# Altium schematic sheet MB_power_supply.SchDoc
size A3
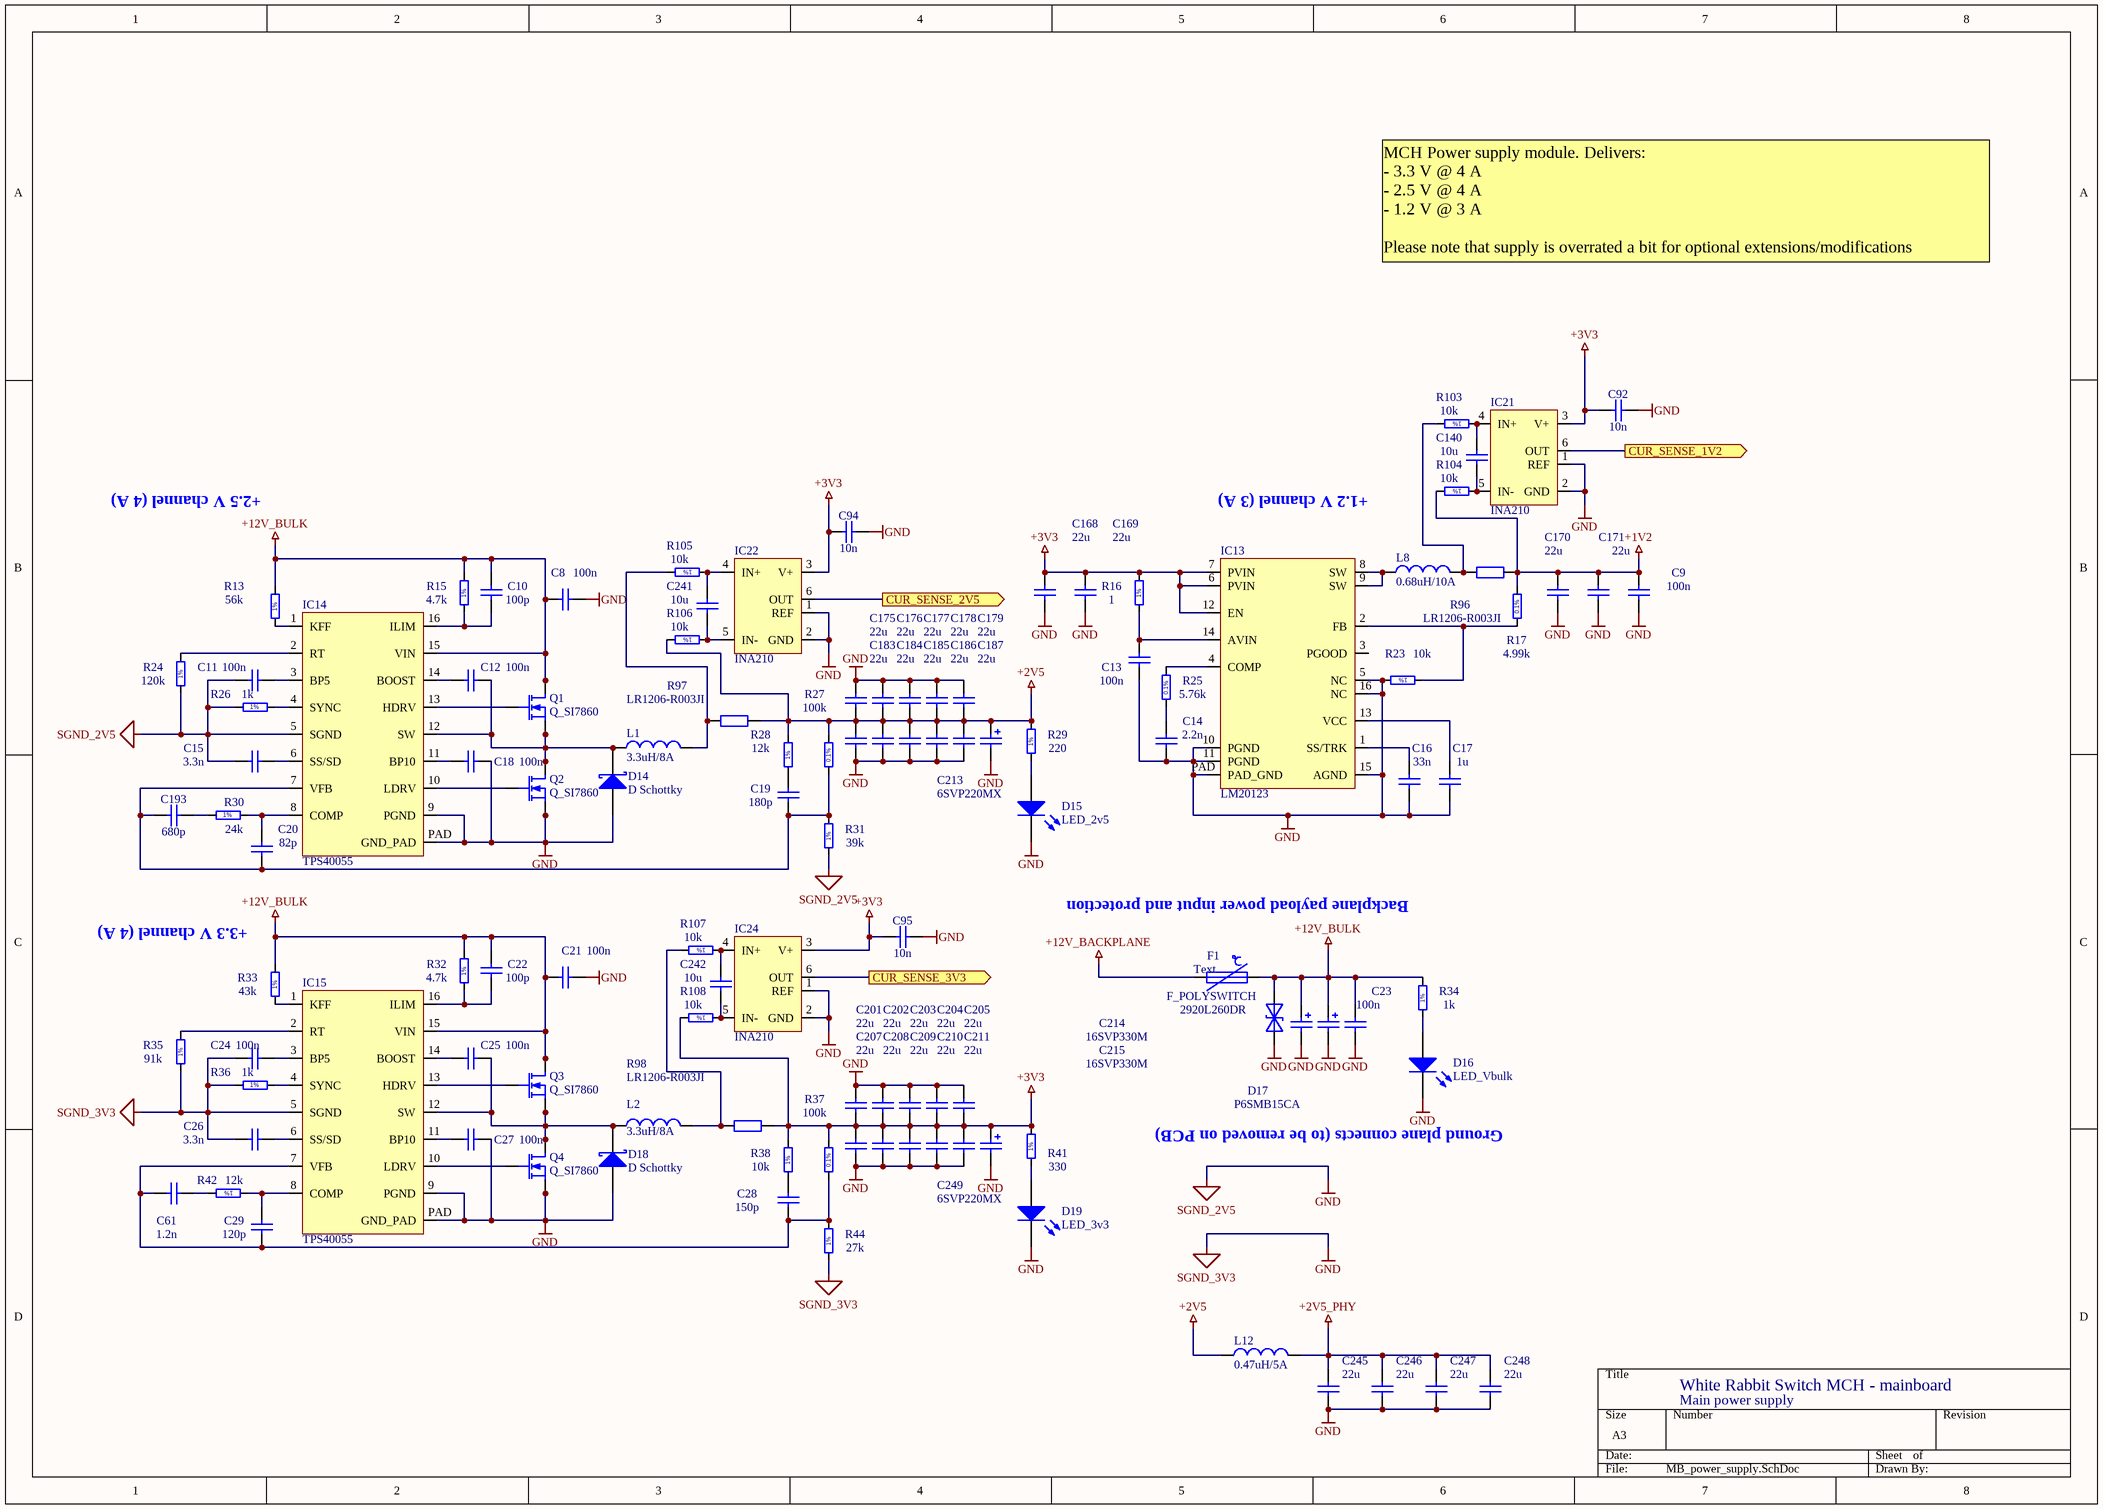
[diagram p0: MB_power_supply.SchDoc]

## Parts
C8  100n  [CAPC1608X87N]
C9  100n  [CAPC1608X87N]
C10  100p  [CAPC1608X87N]
C11  100n  [CAPC1608X87N]
C12  100n  [CAPC1608X87N]
C13  100n  [CAPC1608X87N]
C14  2.2n  [CAPC1608X87N]
C15  3.3n  [CAPC1608X87N]
C16  33n  [CAPC1608X87N]
C17  1u  [CAPC1608X87N]
C18  100n  [CAPC1608X87N]
C19  180p  [CAPC1608X87N]
C20  82p  [CAPC1608X87N]
C21  100n  [CAPC1608X87N]
C22  100p  [CAPC1608X87N]
C23  100n  [CAPC1608X87N]
C24  100n  [CAPC1608X87N]
C25  100n  [CAPC1608X87N]
C26  3.3n  [CAPC1608X87N]
C27  100n  [CAPC1608X87N]
C28  150p  [CAPC1608X87N]
C29  120p  [CAPC1608X87N]
C61  1.2n  [CAPC1608X87N]
C92  10n  [CAPC1608X87N]
C94  10n  [CAPC1608X87N]
C95  10n  [CAPC1608X87N]
C140  10u  [CAPC1608X87N]
C168  value 22u  [CC3216-1206]  (hidden comment: Cap)
C169  value 22u  [CC3216-1206]  (hidden comment: Cap)
C170  value 22u  [CC3216-1206]  (hidden comment: Cap)
C171  value 22u  [CC3216-1206]  (hidden comment: Cap)
C175  value 22u  [CC3216-1206]  (hidden comment: Cap)
C176  value 22u  [CC3216-1206]  (hidden comment: Cap)
C177  value 22u  [CC3216-1206]  (hidden comment: Cap)
C178  value 22u  [CC3216-1206]  (hidden comment: Cap)
C179  value 22u  [CC3216-1206]  (hidden comment: Cap)
C183  value 22u  [CC3216-1206]  (hidden comment: Cap)
C184  value 22u  [CC3216-1206]  (hidden comment: Cap)
C185  value 22u  [CC3216-1206]  (hidden comment: Cap)
C186  value 22u  [CC3216-1206]  (hidden comment: Cap)
C187  value 22u  [CC3216-1206]  (hidden comment: Cap)
C193  680p  [CAPC1608X87N]
C201  value 22u  [CC3216-1206]  (hidden comment: Cap)
C202  value 22u  [CC3216-1206]  (hidden comment: Cap)
C203  value 22u  [CC3216-1206]  (hidden comment: Cap)
C204  value 22u  [CC3216-1206]  (hidden comment: Cap)
C205  value 22u  [CC3216-1206]  (hidden comment: Cap)
C207  value 22u  [CC3216-1206]  (hidden comment: Cap)
C208  value 22u  [CC3216-1206]  (hidden comment: Cap)
C209  value 22u  [CC3216-1206]  (hidden comment: Cap)
C210  value 22u  [CC3216-1206]  (hidden comment: Cap)
C211  value 22u  [CC3216-1206]  (hidden comment: Cap)
C213  value 6SVP220MX  [OSCON_E7]  (hidden comment: Cap Pol1)
C214  value 16SVP330M  [OSCON_F12]  (hidden comment: Cap Pol1)
C215  value 16SVP330M  [OSCON_F12]  (hidden comment: Cap Pol1)
C241  10u  [CAPC1608X87N]
C242  10u  [CAPC1608X87N]
C245  value 22u  [CC3216-1206]  (hidden comment: Cap)
C246  value 22u  [CC3216-1206]  (hidden comment: Cap)
C247  value 22u  [CC3216-1206]  (hidden comment: Cap)
C248  value 22u  [CC3216-1206]  (hidden comment: Cap)
C249  value 6SVP220MX  [OSCON_E7]  (hidden comment: Cap Pol1)
D14  D Schottky  [CD3216-1206]
D15  LED_2v5  [CD1608-0603]
D16  LED_Vbulk  [CD1608-0603]
D17  P6SMB15CA  [DO-214AA/SMB]
D18  D Schottky  [CD3216-1206]
D19  LED_3v3  [CD1608-0603]
F1  F_POLYSWITCH  value 2920L260DR  [PTC_SMD_1812]
IC13  LM20123  [eTSSOP_16_MX]
IC14  value TPS40055  [TI_PWP_16]  (hidden comment: TPS4005X)
IC15  value TPS40055  [TI_PWP_16]  (hidden comment: TPS4005X)
IC21  INA210  [TI_6sc70]
IC22  INA210  [TI_6sc70]
IC24  INA210  [TI_6sc70]
L1  3.3uH/8A  [IHLP2525]
L2  3.3uH/8A  [IHLP2525]
L8  0.68uH/10A  [IHLP2525]
L12  0.47uH/5A  [IND_WURTH_744042_MH]
Q1  Q_SI7860  [SOIC127P600-8AL]
Q2  Q_SI7860  [SOIC127P600-8AL]
Q3  Q_SI7860  [SOIC127P600-8AL]
Q4  Q_SI7860  [SOIC127P600-8AL]
R13  56k  [RESC1608X55N]
R15  4.7k  [RESC1608X55N]
R16  1  [RESC1608X55N]
R17  4.99k  [RESC1608X55N]
R23  10k  [RESC1608X55N]
R24  120k  [RESC1608X55N]
R25  5.76k  [RESC1608X55N]
R26  1k  [RESC1608X55N]
R27  100k  [RESC1608X55N]
R28  12k  [RESC1608X55N]
R29  220  [RESC1608X55N]
R30  24k  [RESC1608X55N]
R31  39k  [RESC1608X55N]
R32  4.7k  [RESC1608X55N]
R33  43k  [RESC1608X55N]
R34  1k  [RESC1005X40N]
R35  91k  [RESC1608X55N]
R36  1k  [RESC1608X55N]
R37  100k  [RESC1608X55N]
R38  10k  [RESC1608X55N]
R41  330  [RESC1608X55N]
R42  12k  [RESC1608X55N]
R44  27k  [RESC1608X55N]
R96  value LR1206-R003JI  [CR3216-1206]  (hidden comment: 0.003R)
R97  value LR1206-R003JI  [CR3216-1206]  (hidden comment: 0.003R)
R98  value LR1206-R003JI  [CR3216-1206]  (hidden comment: 0.003R)
R103  10k  [RESC1005X40N]
R104  10k  [RESC1005X40N]
R105  10k  [RESC1005X40N]
R106  10k  [RESC1005X40N]
R107  10k  [RESC1005X40N]
R108  10k  [RESC1005X40N]

## Ports
CUR_SENSE_1V2 (out), CUR_SENSE_2V5 (out), CUR_SENSE_3V3 (out)

## Nets
+1V2: C9.2 C170.2 C171.2 R17.2 R96.1 R104.2
+2V5: C175.1 C176.1 C177.1 C178.1 C179.1 C183.2 C184.2 C185.2 C186.2 C187.2 C213.1 L12.1 R27.2 R28.2 R29.2 R97.1 R106.2
+2V5_PHY: C245.2 C246.2 C247.2 C248.2 L12.2
+3V3: C92.1 C94.1 C95.1 C168.2 C169.2 C201.2 C202.2 C203.2 C204.2 C205.2 C207.1 C208.1 C209.1 C210.1 C211.1 C249.1 IC13.6(PVIN) IC13.7(PVIN) IC13.12(EN) IC21.3(V+) IC22.3(V+) IC24.3(V+) R16.2 R37.2 R38.2 R41.2 R98.1 R108.2
+12V_BACKPLANE: F1.1
+12V_BULK: C8.1 C10.2 C21.1 C22.2 C23.2 C214.1 C215.1 D17.K F1.2 IC14.15(VIN) IC15.15(VIN) Q1.5(D) Q1.6(D) Q1.7(D) Q1.8(D) Q3.5(D) Q3.6(D) Q3.7(D) Q3.8(D) R13.2 R15.2 R32.2 R33.2 R34.2
GND: C8.2 C9.1 C11.1 C13.1 C14.1 C15.1 C16.1 C17.1 C18.2 C21.2 C23.1 C24.1 C26.1 C27.2 C92.2 C94.2 C95.2 C168.1 C169.1 C170.1 C171.1 C175.2 C176.2 C177.2 C178.2 C179.2 C183.1 C184.1 C185.1 C186.1 C187.1 C201.1 C202.1 C203.1 C204.1 C205.1 C207.2 C208.2 C209.2 C210.2 C211.2 C213.2 C214.2 C215.2 C245.1 C246.1 C247.1 C248.1 C249.2 D14.1(A) D15.2(K) D16.2(K) D17.A D18.1(A) D19.2(K) IC13.5(NC) IC13.10(PGND) IC13.11(PGND) IC13.15(AGND) IC13.16(NC) IC13.PAD(PAD_GND) IC14.5(SGND) IC14.9(PGND) IC14.PAD(GND_PAD) IC15.5(SGND) IC15.9(PGND) IC15.PAD(GND_PAD) IC21.1(REF) IC21.2(GND) IC22.1(REF) IC22.2(GND) IC24.1(REF) IC24.2(GND) Q2.1(S) Q2.2(S) Q2.3(S) Q4.1(S) Q4.2(S) Q4.3(S) R23.2 R24.1 R26.1 R31.1 R35.1 R36.1 R44.1  [also labelled SGND_2V5, SGND_3V3]
CUR_SENSE_1V2: IC21.6(OUT) ; port CUR_SENSE_1V2
CUR_SENSE_2V5: IC22.6(OUT) ; port CUR_SENSE_2V5
CUR_SENSE_3V3: IC24.6(OUT) ; port CUR_SENSE_3V3
NetC10_1: C10.1 IC14.16(ILIM) R15.1
NetC11_2: C11.2 IC14.3(BP5)
NetC12_1: C12.1 IC14.14(BOOST)
NetC12_2: C12.2 D14.2(K) IC14.12(SW) L1.1 Q1.1(S) Q1.2(S) Q1.3(S) Q2.5(D) Q2.6(D) Q2.7(D) Q2.8(D)
NetC13_2: C13.2 IC13.14(AVIN) R16.1
NetC14_2: C14.2 R25.1
NetC15_2: C15.2 IC14.6(SS/SD)
NetC16_2: C16.2 IC13.1(SS/TRK)
NetC17_2: C17.2 IC13.13(VCC)
NetC18_1: C18.1 IC14.11(BP10)
NetC19_1: C19.1 C20.1 C193.1 IC14.7(VFB) R27.1 R31.2
NetC19_2: C19.2 R28.1
NetC20_2: C20.2 IC14.8(COMP) R30.2
NetC22_1: C22.1 IC15.16(ILIM) R32.1
NetC24_2: C24.2 IC15.3(BP5)
NetC25_1: C25.1 IC15.14(BOOST)
NetC25_2: C25.2 D18.2(K) IC15.12(SW) L2.1 Q3.1(S) Q3.2(S) Q3.3(S) Q4.5(D) Q4.6(D) Q4.7(D) Q4.8(D)
NetC26_2: C26.2 IC15.6(SS/SD)
NetC27_1: C27.1 IC15.11(BP10)
NetC28_1: C28.1 C29.1 C61.1 IC15.7(VFB) R37.1 R44.2
NetC28_2: C28.2 R38.1
NetC29_2: C29.2 IC15.8(COMP) R42.1
NetC61_2: C61.2 R42.2
NetC140_1: C140.1 IC21.5(IN-) R104.1
NetC140_2: C140.2 IC21.4(IN+) R103.1
NetC193_2: C193.2 R30.1
NetC241_1: C241.1 IC22.5(IN-) R106.1
NetC241_2: C241.2 IC22.4(IN+) R105.1
NetC242_1: C242.1 IC24.5(IN-) R108.1
NetC242_2: C242.2 IC24.4(IN+) R107.1
NetD15_1: D15.1(A) R29.1
NetD16_1: D16.1(A) R34.1
NetD19_1: D19.1(A) R41.1
NetIC13_2: IC13.2(FB) R17.1 R23.1
NetIC13_4: IC13.4(COMP) R25.2
NetIC13_8: IC13.8(SW) IC13.9(SW) L8.1
NetIC14_1: IC14.1(KFF) R13.1
NetIC14_2: IC14.2(RT) R24.2
NetIC14_4: IC14.4(SYNC) R26.2
NetIC14_10: IC14.10(LDRV) Q2.4(G)
NetIC14_13: IC14.13(HDRV) Q1.4(G)
NetIC15_1: IC15.1(KFF) R33.1
NetIC15_2: IC15.2(RT) R35.2
NetIC15_4: IC15.4(SYNC) R36.2
NetIC15_10: IC15.10(LDRV) Q4.4(G)
NetIC15_13: IC15.13(HDRV) Q3.4(G)
NetL1_2: L1.2 R97.2 R105.2
NetL2_2: L2.2 R98.2 R107.2
NetL8_2: L8.2 R96.2 R103.2

Not connected (* = marked no-connect by the designer): IC13 3(PGOOD)

## Notes on the sheet
- !
- MCH Power supply module. Delivers:
  - 3.3 V @ 4 A
  - 2.5 V @ 4 A
  - 1.2 V @ 3 A
  Please note that supply is overrated a bit for optional extensions/modifications
- +2.5 V channel (4 A)
- +1.2 V channel (3 A)
- (near R33) +3.3 V channel (4 A)
- Backplane payload power input and protection
- (near F1) Text
- Ground plane connects (to be removed on PCB)
- White Rabbit Switch MCH - mainboard
- Main power supply
- (in symbol R0402_1K_1%_0.0625W_100PPM) 1%
- (in symbol R0402_10K_1%_0.0625W_100PPM) 1%
- (in symbol R0603_1K_1%_0.1W_100PPM) 1%
- (in symbol R0603_1R_1%_0.1W_100PPM) 1%
- (in symbol R0603_4K7_1%_0.1W_100PPM) 1%
- (in symbol R0603_4K99_0.1%_0.063W_10PPM) 0.1%
- (in symbol R0603_5K76_0.1%_0.063W_10PPM) 0.1%
- (in symbol R0603_10K_1%_0.1W_100PPM) 1%
- (in symbol R0603_12K_1%_0.1W_100PPM) 1%
- (in symbol R0603_24K_1%_0.1W_100PPM) 1%
- (in symbol R0603_27K_1%_0.1W_100PPM) 1%
- (in symbol R0603_39K_1%_0.1W_100PPM) 1%
- (in symbol R0603_43K_1%_0.1W_100PPM) 1%
- (in symbol R0603_56K_1%_0.1W_100PPM) 1%
- (in symbol R0603_91K_1%_0.1W_100PPM) 1%
- (in symbol R0603_100K_0.1%_0.063W_10PPM) 0.1%
- (in symbol R0603_120K_1%_0.1W_100PPM) 1%
- (in symbol R0603_220R_1%_0.1W_100PPM) 1%
- (in symbol R0603_330R_1%_0.1W_100PPM) 1%

## Library data of the parts
C8 C9 C11-C13 C18 C21 C23-C25 C27 = CC0603_100NF_50V_10%_X7R: Non-polarised capacitor; Part Description: SMD Multilayer Chip Ceramic Capacitor; Manufacturer: GENERIC; Manufacturer1 Part Number: 223858615649; Manufacturer1 Datasheet: \\cern.ch\dfs\Applications\Altium\Datasheets\CC0603_X7R_PHYCOMP.pdf; Value: 100nF; Voltage: 50V; TC: X7R; Tolerance: ±10%; Table: Capacitors SMD; Part Number: CC0603_100NF_50V_10%_X7R; Component Kind: Standard; Component Type: Standard; Designator: Capacitor - non polarized; Library Reference: Capacitor - non polarized; Pin Count: 2; Status: Preferred; Manufacturer Part Number: CC0603_100NF_50V_10%_X7R; Case: 0603; Mounted: Yes; Socket: No; SMD: Yes; Manufacturer1 Example: PHYCOMP; Manufacturer1 ComponentHeight: 0.87mm; HelpURL: \\cern.ch\dfs\Applications\Altium\Datasheets\CC0603_X7R_PHYCOMP.pdf; Author: CERN DEM JLC; CreateDate: 12/3/2007; LatestRevisionDate: 12/3/2007
  C8 C11 C12 C18: ClassName: PSU_2V5
  C9 C13: ClassName: PSU_1V2
  C21 C24 C25 C27: ClassName: PSU_3V3
C10 C22 = CC0603_100PF_50V_5%_NP0: Non-polarised capacitor; Part Description: SMD Multilayer Chip Ceramic Capacitor; Manufacturer: GENERIC; Manufacturer1 Part Number: 223886715101; Manufacturer1 Datasheet: \\cern.ch\dfs\Applications\Altium\Datasheets\CC0603_NP0_PHYCOMP.pdf; Value: 100pF; Voltage: 50V; TC: NP0; Tolerance: ±5%; Table: Capacitors SMD; Part Number: CC0603_100PF_50V_5%_NP0; Component Kind: Standard; Component Type: Standard; Designator: Capacitor - non polarized; Library Reference: Capacitor - non polarized; Pin Count: 2; Status: Preferred; Manufacturer Part Number: CC0603_100PF_50V_5%_NP0; Case: 0603; Mounted: Yes; Socket: No; SMD: Yes; Manufacturer1 Example: PHYCOMP; Manufacturer1 ComponentHeight: 0.87mm; HelpURL: \\cern.ch\dfs\Applications\Altium\Datasheets\CC0603_NP0_PHYCOMP.pdf; Author: CERN DEM JLC; CreateDate: 12/3/2007; LatestRevisionDate: 12/3/2007
  C10: ClassName: PSU_2V5
  C22: ClassName: PSU_3V3
C14 = CC0603_2.2NF_50V_10%_X7R: Non-polarised capacitor; Part Description: SMD Multilayer Chip Ceramic Capacitor; Manufacturer: GENERIC; Manufacturer1 Part Number: 223858615627; Manufacturer1 Datasheet: \\cern.ch\dfs\Applications\Altium\Datasheets\CC0603_X7R_PHYCOMP.pdf; Value: 2.2nF; Voltage: 50V; TC: X7R; Tolerance: ±10%; Table: Capacitors SMD; Part Number: CC0603_2.2NF_50V_10%_X7R; Component Kind: Standard; Component Type: Standard; Designator: Capacitor - non polarized; Library Reference: Capacitor - non polarized; Pin Count: 2; Status: Preferred; Manufacturer Part Number: CC0603_2.2NF_50V_10%_X7R; Case: 0603; Mounted: Yes; Socket: No; SMD: Yes; Manufacturer1 Example: PHYCOMP; Manufacturer1 ComponentHeight: 0.87mm; HelpURL: \\cern.ch\dfs\Applications\Altium\Datasheets\CC0603_X7R_PHYCOMP.pdf; Author: CERN DEM JLC; CreateDate: 12/3/2007; LatestRevisionDate: 12/3/2007; ClassName: PSU_1V2
C15 C26 = CC0603_3.3NF_50V_10%_X7R: Non-polarised capacitor; Part Description: SMD Multilayer Chip Ceramic Capacitor; Manufacturer: GENERIC; Manufacturer1 Part Number: 223858615629; Manufacturer1 Datasheet: \\cern.ch\dfs\Applications\Altium\Datasheets\CC0603_X7R_PHYCOMP.pdf; Value: 3.3nF; Voltage: 50V; TC: X7R; Tolerance: ±10%; Table: Capacitors SMD; Part Number: CC0603_3.3NF_50V_10%_X7R; Component Kind: Standard; Component Type: Standard; Designator: Capacitor - non polarized; Library Reference: Capacitor - non polarized; Pin Count: 2; Status: Preferred; Manufacturer Part Number: CC0603_3.3NF_50V_10%_X7R; Case: 0603; Mounted: Yes; Socket: No; SMD: Yes; Manufacturer1 Example: PHYCOMP; Manufacturer1 ComponentHeight: 0.87mm; HelpURL: \\cern.ch\dfs\Applications\Altium\Datasheets\CC0603_X7R_PHYCOMP.pdf; Author: CERN DEM JLC; CreateDate: 12/3/2007; LatestRevisionDate: 12/3/2007
  C15: ClassName: PSU_2V5
  C26: ClassName: PSU_3V3
C16 = CC0603_33NF_25V_10%_X7R: Non-polarised capacitor; Part Description: SMD Multilayer Chip Ceramic Capacitor; Manufacturer: GENERIC; Manufacturer1 Part Number: 223891615643; Manufacturer1 Datasheet: \\cern.ch\dfs\Applications\Altium\Datasheets\CC0603_X7R_PHYCOMP.pdf; Value: 33nF; Voltage: 25V; TC: X7R; Tolerance: ±10%; Table: Capacitors SMD; Part Number: CC0603_33NF_25V_10%_X7R; Component Kind: Standard; Component Type: Standard; Designator: Capacitor - non polarized; Library Reference: Capacitor - non polarized; Pin Count: 2; Status: Preferred; Manufacturer Part Number: CC0603_33NF_25V_10%_X7R; Case: 0603; Mounted: Yes; Socket: No; SMD: Yes; Manufacturer1 Example: PHYCOMP; Manufacturer1 ComponentHeight: 0.87mm; HelpURL: \\cern.ch\dfs\Applications\Altium\Datasheets\CC0603_X7R_PHYCOMP.pdf; Author: CERN DEM JLC; CreateDate: 12/3/2007; LatestRevisionDate: 12/3/2007; ClassName: PSU_1V2
C17 = CC0603_1.0uF_16V_10%_X7R: Non-polarised capacitor; Part Description: SMD Multilayer Chip Ceramic Capacitor; Manufacturer: GENERIC; Manufacturer1 Part Number: 223824613663; Manufacturer1 Datasheet: \\cern.ch\dfs\Applications\Altium\Datasheets\CC0805_X5R_PHYCOMP_HC.pdf; Value: 1uF; Voltage: 16V; TC: X7R; Tolerance: ±10%; Table: Capacitors SMD; Part Number: CC0603_1.0uF_16V_10%_X7R; Component Kind: Standard; Component Type: Standard; Designator: Capacitor - non polarized; Library Reference: Capacitor - non polarized; Pin Count: 2; Status: Preferred; Manufacturer Part Number: CC0603_1.0uF_16V_10%_X7R; Case: 0603; Mounted: Yes; Socket: No; SMD: Yes; Manufacturer1 Example: PHYCOMP; Manufacturer1 ComponentHeight: 0.87mm; HelpURL: \\cern.ch\dfs\Applications\Altium\Datasheets\CC0805_X5R_PHYCOMP_HC.pdf; Author: CERN DEM JLC; CreateDate: 12/3/2007; LatestRevisionDate: 12/3/2007; ClassName: PSU_1V2
C19 = CC0603_180PF_50V_5%_NP0: Non-polarised capacitor; Part Description: SMD Multilayer Chip Ceramic Capacitor; Manufacturer: GENERIC; Manufacturer1 Part Number: 223886715181; Manufacturer1 Datasheet: \\cern.ch\dfs\Applications\Altium\Datasheets\CC0603_NP0_PHYCOMP.pdf; Value: 180pF; Voltage: 50V; TC: NP0; Tolerance: ±5%; Table: Capacitors SMD; Part Number: CC0603_180PF_50V_5%_NP0; Component Kind: Standard; Component Type: Standard; Designator: Capacitor - non polarized; Library Reference: Capacitor - non polarized; Pin Count: 2; Status: Preferred; Manufacturer Part Number: CC0603_180PF_50V_5%_NP0; Case: 0603; Mounted: Yes; Socket: No; SMD: Yes; Manufacturer1 Example: PHYCOMP; Manufacturer1 ComponentHeight: 0.87mm; HelpURL: \\cern.ch\dfs\Applications\Altium\Datasheets\CC0603_NP0_PHYCOMP.pdf; Author: CERN DEM JLC; CreateDate: 12/3/2007; LatestRevisionDate: 12/3/2007; ClassName: PSU_2V5
C20 = CC0603_82PF_50V_5%_NP0: Non-polarised capacitor; Part Description: SMD Multilayer Chip Ceramic Capacitor; Manufacturer: GENERIC; Manufacturer1 Part Number: 223886715829; Manufacturer1 Datasheet: \\cern.ch\dfs\Applications\Altium\Datasheets\CC0603_NP0_PHYCOMP.pdf; Value: 82pF; Voltage: 50V; TC: NP0; Tolerance: ±5%; Table: Capacitors SMD; Part Number: CC0603_82PF_50V_5%_NP0; Component Kind: Standard; Component Type: Standard; Designator: Capacitor - non polarized; Library Reference: Capacitor - non polarized; Pin Count: 2; Status: Preferred; Manufacturer Part Number: CC0603_82PF_50V_5%_NP0; Case: 0603; Mounted: Yes; Socket: No; SMD: Yes; Manufacturer1 Example: PHYCOMP; Manufacturer1 ComponentHeight: 0.87mm; HelpURL: \\cern.ch\dfs\Applications\Altium\Datasheets\CC0603_NP0_PHYCOMP.pdf; Author: CERN DEM JLC; CreateDate: 12/3/2007; LatestRevisionDate: 12/3/2007; ClassName: PSU_2V5
C28 = CC0603_150PF_50V_5%_NP0: Non-polarised capacitor; Part Description: SMD Multilayer Chip Ceramic Capacitor; Manufacturer: GENERIC; Manufacturer1 Part Number: 223886715151; Manufacturer1 Datasheet: \\cern.ch\dfs\Applications\Altium\Datasheets\CC0603_NP0_PHYCOMP.pdf; Value: 150pF; Voltage: 50V; TC: NP0; Tolerance: ±5%; Table: Capacitors SMD; Part Number: CC0603_150PF_50V_5%_NP0; Component Kind: Standard; Component Type: Standard; Designator: Capacitor - non polarized; Library Reference: Capacitor - non polarized; Pin Count: 2; Status: Preferred; Manufacturer Part Number: CC0603_150PF_50V_5%_NP0; Case: 0603; Mounted: Yes; Socket: No; SMD: Yes; Manufacturer1 Example: PHYCOMP; Manufacturer1 ComponentHeight: 0.87mm; HelpURL: \\cern.ch\dfs\Applications\Altium\Datasheets\CC0603_NP0_PHYCOMP.pdf; Author: CERN DEM JLC; CreateDate: 12/3/2007; LatestRevisionDate: 12/3/2007; ClassName: PSU_3V3
C29 = CC0603_120PF_50V_5%_NP0: Non-polarised capacitor; Part Description: SMD Multilayer Chip Ceramic Capacitor; Manufacturer: GENERIC; Manufacturer1 Part Number: 223886715121; Manufacturer1 Datasheet: \\cern.ch\dfs\Applications\Altium\Datasheets\CC0603_NP0_PHYCOMP.pdf; Value: 120pF; Voltage: 50V; TC: NP0; Tolerance: ±5%; Table: Capacitors SMD; Part Number: CC0603_120PF_50V_5%_NP0; Component Kind: Standard; Component Type: Standard; Designator: Capacitor - non polarized; Library Reference: Capacitor - non polarized; Pin Count: 2; Status: Preferred; Manufacturer Part Number: CC0603_120PF_50V_5%_NP0; Case: 0603; Mounted: Yes; Socket: No; SMD: Yes; Manufacturer1 Example: PHYCOMP; Manufacturer1 ComponentHeight: 0.87mm; HelpURL: \\cern.ch\dfs\Applications\Altium\Datasheets\CC0603_NP0_PHYCOMP.pdf; Author: CERN DEM JLC; CreateDate: 12/3/2007; LatestRevisionDate: 12/3/2007; ClassName: PSU_3V3
C61 = CC0603_1.2NF_50V_10%_X7R: Non-polarised capacitor; Part Description: SMD Multilayer Chip Ceramic Capacitor; Manufacturer: GENERIC; Manufacturer1 Part Number: 223858615624; Manufacturer1 Datasheet: \\cern.ch\dfs\Applications\Altium\Datasheets\CC0603_X7R_PHYCOMP.pdf; Value: 1.2nF; Voltage: 50V; TC: X7R; Tolerance: ±10%; Table: Capacitors SMD; Part Number: CC0603_1.2NF_50V_10%_X7R; Component Kind: Standard; Component Type: Standard; Designator: Capacitor - non polarized; Library Reference: Capacitor - non polarized; Pin Count: 2; Status: Preferred; Manufacturer Part Number: CC0603_1.2NF_50V_10%_X7R; Case: 0603; Mounted: Yes; Socket: No; SMD: Yes; Manufacturer1 Example: PHYCOMP; Manufacturer1 ComponentHeight: 0.87mm; HelpURL: \\cern.ch\dfs\Applications\Altium\Datasheets\CC0603_X7R_PHYCOMP.pdf; Author: CERN DEM JLC; CreateDate: 12/3/2007; LatestRevisionDate: 12/3/2007; ClassName: PSU_3V3
C92 C94 C95 = CC0603_10NF_50V_10%_X7R: Non-polarised capacitor; Part Description: SMD Multilayer Chip Ceramic Capacitor; Manufacturer: GENERIC; Manufacturer1 Part Number: 223858615636; Manufacturer1 Datasheet: \\cern.ch\dfs\Applications\Altium\Datasheets\CC0603_X7R_PHYCOMP.pdf; Value: 10nF; Voltage: 50V; TC: X7R; Tolerance: ±10%; Table: Capacitors SMD; Part Number: CC0603_10NF_50V_10%_X7R; Component Kind: Standard; Component Type: Standard; Designator: Capacitor - non polarized; Library Reference: Capacitor - non polarized; Pin Count: 2; Status: Preferred; Manufacturer Part Number: CC0603_10NF_50V_±10%_X7R; Case: 0603; Mounted: Yes; Socket: No; SMD: Yes; Manufacturer1 Example: PHYCOMP; Manufacturer1 ComponentHeight: 0.87mm; HelpURL: \\cern.ch\dfs\Applications\Altium\Datasheets\CC0603_X7R_PHYCOMP.pdf; Author: CERN DEM JLC; CreateDate: 12/3/2007; LatestRevisionDate: 12/3/2007
  C92: ClassName: PSU_1V2
  C94: ClassName: PSU_2V5
  C95: ClassName: PSU_3V3
C140 C241 C242 = CC0603_10uF_6.3V_20%_X5R: Non-polarised capacitor; Part Description: SMD Multilayer Chip Ceramic Capacitor; Manufacturer: GENERIC; Manufacturer1 Part Number: C0603C106M9PAC; Manufacturer1 Datasheet: \\cern.ch\dfs\Applications\Altium\Datasheets\CC0603_X5R_KEMET.pdf; Value: 10uF; Voltage: 6.3V; TC: X5R; Tolerance: ±20%; Table: Capacitors SMD; Part Number: CC0603_10uF_6.3V_20%_X5R; Component Kind: Standard; Component Type: Standard; Designator: Capacitor - non polarized; Library Reference: Capacitor - non polarized; Pin Count: 2; Status: Preferred; Manufacturer Part Number: CC0603_10uF_6.3V_20%_X5R; Case: 0603; Mounted: Yes; Socket: No; SMD: Yes; Manufacturer1 Example: KEMET; Manufacturer1 ComponentHeight: 0.95mm; HelpURL: \\cern.ch\dfs\Applications\Altium\Datasheets\CC0603_X5R_KEMET.pdf; Author: CERN DEM JLC; CreateDate: 2007-12-03; LatestRevisionDate: 2007-12-03
C168-C171 C175-C179 C183-C187 C201-C205 C207-C211 C245-C248 = Cap: Capacitor; RefId: 1463399; Published: 8-Jun-2000; LatestRevisionDate: 17-Jul-2002; LatestRevisionNote: Re-released for DXP Platform.; PackageReference: RAD-0.3; Publisher: Altium Limited; Supplier: Farnell
  C168-C171: ClassName: PSU_1V2
  C175-C179 C183-C187 C245-C248: ClassName: PSU_2V5
  C201-C205 C207-C211: ClassName: PSU_3V3
C193 = CC0603_680PF_50V_5%_NP0: Non-polarised capacitor; Part Description: SMD Multilayer Chip Ceramic Capacitor; Manufacturer: GENERIC; Manufacturer1 Part Number: 223886715681; Manufacturer1 Datasheet: \\cern.ch\dfs\Applications\Altium\Datasheets\CC0603_NP0_PHYCOMP.pdf; Value: 680pF; Voltage: 50V; TC: NP0; Tolerance: ±5%; Table: Capacitors SMD; Part Number: CC0603_680PF_50V_5%_NP0; Component Kind: Standard; Component Type: Standard; Designator: Capacitor - non polarized; Library Reference: Capacitor - non polarized; Pin Count: 2; Status: Preferred; Manufacturer Part Number: CC0603_680PF_50V_5%_NP0; Case: 0603; Mounted: Yes; Socket: No; SMD: Yes; Manufacturer1 Example: PHYCOMP; Manufacturer1 ComponentHeight: 0.87mm; HelpURL: \\cern.ch\dfs\Applications\Altium\Datasheets\CC0603_NP0_PHYCOMP.pdf; Author: CERN DEM JLC; CreateDate: 12/3/2007; LatestRevisionDate: 12/3/2007
C213 C249 = Cap Pol1: Polarized Capacitor (Radial); RefId: 9188819; Published: 8-Jun-2000; LatestRevisionDate: 17-Jul-2002; LatestRevisionNote: Re-released for DXP Platform.; PackageReference: RB7.6-15; Publisher: Altium Limited; Supplier: Farnell
  C213: ClassName: PSU_2V5
  C249: ClassName: PSU_3V3
C214 C215 = Cap Pol1: Polarized Capacitor (Radial); RefId: 9189084; Published: 8-Jun-2000; LatestRevisionDate: 17-Jul-2002; LatestRevisionNote: Re-released for DXP Platform.; PackageReference: RB7.6-15; Publisher: Altium Limited; Supplier: Farnell
D14 D18 = D Schottky: Schottky Diode; Published: 8-Jun-2000; LatestRevisionDate: 17-Jul-2002; LatestRevisionNote: Re-released for DXP Platform.; PackageReference: SMB; Publisher: Altium Limited; Code_JEDEC: DO-214-AA
  D14: ClassName: PSU_2V5
  D18: ClassName: PSU_3V3
D15 D16 D19 = LED0: Red chip LED; Published: 8-Jun-2000; LatestRevisionDate: 08-Jul-2005; LatestRevisionNote: Mech Layer 1 removed.; PackageReference: LED-0; Publisher: Altium Limited
  D15: ClassName: PSU_2V5
  D19: ClassName: PSU_3V3
D17 = D_TRANSIL_SMD_0.6KW: transil 600W; RefId: 1390860; Supplier: Farnell; Value: P6SMB15CA
F1 = F_POLYSWITCH: polymer FUSE; RefId: 1309799; Supplier: Farnell
IC13 = LM20123: National Semiconductor 3A integrated synchronous buck converter; RefId: 1506824; Supplier: Farnell; Value: LM20123; ClassName: PSU_1V2
IC14 IC15 = TPS4005X: TI synchronous buck controller; RefId: 1535777; Supplier: Farnell
  IC14: ClassName: PSU_2V5
  IC15: ClassName: PSU_3V3
IC21 IC22 IC24 = INA210_214: High/low side current monitor; Supplier: Farnell; Value: INA210
  IC21: ClassName: PSU_1V2
  IC22: ClassName: PSU_2V5
  IC24: ClassName: PSU_3V3
L1 L2 = L_IHLP2525_0.68u: Vishay 16A 2.2u inductor; Value: IHLP2525CZER3R3M01; RefId: 1187066; Supplier: Farnell
  L1: ClassName: PSU_2V5
  L2: ClassName: PSU_3V3
L8 = L_IHLP2525_0.68u: Vishay 16A 2.2u inductor; Value: IHLP2525CZER0R68; RefId: 4829049; Supplier: Farnell; ClassName: PSU_1V2
L12 = L_WUERTH_744043: Wuerth small footprint SMD power inductor; Value: 74404300047; Supplier: Mouser; RefId: 74404300047
Q1-Q4 = Q_SI7860: 18A 8mOhm N-Channel MOSFET; PackageDocument: 1995/1996; RefId: 1653688; Value: SI7860DP; Published: 8-Jun-2000; LatestRevisionDate: 17-Jul-2002; LatestRevisionNote: Re-released for DXP Platform.; PackageReference: E3; Publisher: Altium Limited; Supplier: Farnell
  Q1 Q2: ClassName: PSU_2V5
  Q3 Q4: ClassName: PSU_3V3
R13 = R0603_56K_1%_0.1W_100PPM: Resistor - 1%; Part Description: General Purpose Thick Film Chip Resistor; Manufacturer: GENERIC; Manufacturer1 Part Number: NRC06F5602TRF; Manufacturer1 Datasheet: \\cern.ch\dfs\Applications\Altium\Datasheets\R0603_NIC_NRC.pdf; Power: 0.1W; TC: ±100ppm/°C; Table: Resistors SMD; Part Number: R0603_56K_1%_0.1W_100PPM; Component Kind: Standard; Component Type: Standard; Designator: Resistor - 1%; Library Reference: Resistor - 1%; Pin Count: 2; Value: 56k; Status: Preferred; Tolerance: ±1%; Manufacturer Part Number: R0603_56K_1%_0.1W_100PPM; Case: 0603; Mounted: Yes; Socket: No; SMD: Yes; Manufacturer1 Example: NIC COMPONENT; Manufacturer1 ComponentHeight: 0.55mm; HelpURL: \\cern.ch\dfs\Applications\Altium\Datasheets\R0603_NIC_NRC.pdf; Author: CERN DEM JLC; CreateDate: 12/3/2007; LatestRevisionDate: 3/13/2008; ClassName: PSU_2V5
R15 R32 = R0603_4K7_1%_0.1W_100PPM: Resistor - 1%; Part Description: General Purpose Thick Film Chip Resistor; Manufacturer: GENERIC; Manufacturer1 Part Number: NRC06F4701TRF; Manufacturer1 Datasheet: \\cern.ch\dfs\Applications\Altium\Datasheets\R0603_NIC_NRC.pdf; Value: 4k7; Power: 0.1W; TC: ±100ppm/°C; Table: Resistors SMD; Part Number: R0603_4K7_1%_0.1W_100PPM; Component Kind: Standard; Component Type: Standard; Designator: Resistor - 1%; Library Reference: Resistor - 1%; Pin Count: 2; Status: Preferred; Tolerance: ±1%; Manufacturer Part Number: R0603_4K7_1%_0.1W_100PPM; Case: 0603; Mounted: Yes; Socket: No; SMD: Yes; Manufacturer1 Example: NIC COMPONENT; Manufacturer1 ComponentHeight: 0.55mm; HelpURL: \\cern.ch\dfs\Applications\Altium\Datasheets\R0603_NIC_NRC.pdf; Author: CERN DEM JLC; CreateDate: 12/3/2007; LatestRevisionDate: 3/13/2008
  R15: ClassName: PSU_2V5
  R32: ClassName: PSU_3V3
R16 = R0603_1R_1%_0.1W_100PPM: Resistor - 1%; Part Description: General Purpose Thick Film Chip Resistor; Manufacturer: GENERIC; Manufacturer1 Part Number: 232270461008; Manufacturer1 Datasheet: \\cern.ch\dfs\Applications\Altium\Datasheets\R0603_Phycomp_RC0603.pdf; Power: 0.1W; TC: ±100ppm/°C; Table: Resistors SMD; Part Number: R0603_1R_1%_0.1W_100PPM; Component Kind: Standard; Component Type: Standard; Designator: Resistor - 1%; Library Reference: Resistor - 1%; Pin Count: 2; Value: 1; Status: Preferred; Tolerance: ±1%; Manufacturer Part Number: R0603_1R_1%_0.1W_100PPM; Case: 0603; Mounted: Yes; Socket: No; SMD: Yes; Manufacturer1 Example: PHYCOMP; Manufacturer1 ComponentHeight: 0.65mm; HelpURL: \\cern.ch\dfs\Applications\Altium\Datasheets\R0603_Phycomp_RC0603.pdf; Author: CERN DEM JLC; CreateDate: 12/3/2007; LatestRevisionDate: 3/13/2008; ClassName: PSU_1V2
R17 = R0603_4K99_0.1%_0.063W_10PPM: Resistor - 0.1%; Part Description: Thin Film Chip Resistor; Manufacturer: GENERIC; Manufacturer1 Part Number: RN73C1J4K99BTDF; Manufacturer1 Datasheet: \\cern.ch\dfs\Applications\Altium\Datasheets\R0603_Tyco_RN73.pdf; Value: 4k99; Power: 0.063W; TC: ±10ppm; Table: Resistors SMD; Part Number: R0603_4K99_0.1%_0.063W_10PPM; Component Kind: Standard; Component Type: Standard; Designator: Resistor - 0.1%; Library Reference: Resistor - 0.1%; Pin Count: 2; Status: Not recommended; Tolerance: ±0.1%; Manufacturer Part Number: R0603_4K99_0.1%_0.063W_10PPM; Case: 0603; Mounted: Yes; Socket: No; SMD: Yes; Manufacturer1 Example: TYCO HOLSWORTHY; Manufacturer1 ComponentHeight: 0.5mm; HelpURL: \\cern.ch\dfs\Applications\Altium\Datasheets\R0603_Tyco_RN73.pdf; Author: CERN DEM JLC; CreateDate: 12/3/2007; LatestRevisionDate: 3/13/2008; ClassName: PSU_1V2
R23 R38 = R0603_10K_1%_0.1W_100PPM: Resistor - 1%; Part Description: General Purpose Thick Film Chip Resistor; Manufacturer: GENERIC; Manufacturer1 Part Number: NRC06F1002TRF; Manufacturer1 Datasheet: \\cern.ch\dfs\Applications\Altium\Datasheets\R0603_NIC_NRC.pdf; Power: 0.1W; TC: ±100ppm/°C; Table: Resistors SMD; Part Number: R0603_10K_1%_0.1W_100PPM; Component Kind: Standard; Component Type: Standard; Designator: Resistor - 1%; Library Reference: Resistor - 1%; Pin Count: 2; Value: 10k; Status: Preferred; Tolerance: ±1%; Manufacturer Part Number: R0603_10K_1%_0.1W_100PPM; Case: 0603; Mounted: Yes; Socket: No; SMD: Yes; Manufacturer1 Example: NIC COMPONENT; Manufacturer1 ComponentHeight: 0.55mm; HelpURL: \\cern.ch\dfs\Applications\Altium\Datasheets\R0603_NIC_NRC.pdf; Author: CERN DEM JLC; CreateDate: 12/3/2007; LatestRevisionDate: 3/13/2008
  R23: ClassName: PSU_1V2
  R38: ClassName: PSU_3V3
R24 = R0603_120K_1%_0.1W_100PPM: Resistor - 1%; Part Description: General Purpose Thick Film Chip Resistor; Manufacturer: GENERIC; Manufacturer1 Part Number: NRC06F1203TRF; Manufacturer1 Datasheet: \\cern.ch\dfs\Applications\Altium\Datasheets\R0603_NIC_NRC.pdf; Power: 0.1W; TC: ±100ppm/°C; Table: Resistors SMD; Part Number: R0603_120K_1%_0.1W_100PPM; Component Kind: Standard; Component Type: Standard; Designator: Resistor - 1%; Library Reference: Resistor - 1%; Pin Count: 2; Value: 120k; Status: Preferred; Tolerance: ±1%; Manufacturer Part Number: R0603_120K_1%_0.1W_100PPM; Case: 0603; Mounted: Yes; Socket: No; SMD: Yes; Manufacturer1 Example: NIC COMPONENT; Manufacturer1 ComponentHeight: 0.55mm; HelpURL: \\cern.ch\dfs\Applications\Altium\Datasheets\R0603_NIC_NRC.pdf; Author: CERN DEM JLC; CreateDate: 12/3/2007; LatestRevisionDate: 3/13/2008; ClassName: PSU_2V5
R25 = R0603_5K76_0.1%_0.063W_10PPM: Resistor - 0.1%; Part Description: Thin Film Chip Resistor; Manufacturer: GENERIC; Manufacturer1 Part Number: RN73C1J5K76BTDF; Manufacturer1 Datasheet: \\cern.ch\dfs\Applications\Altium\Datasheets\R0603_Tyco_RN73.pdf; Value: 5k76; Power: 0.063W; TC: ±10ppm; Table: Resistors SMD; Part Number: R0603_5K76_0.1%_0.063W_10PPM; Component Kind: Standard; Component Type: Standard; Designator: Resistor - 0.1%; Library Reference: Resistor - 0.1%; Pin Count: 2; Status: Not recommended; Tolerance: ±0.1%; Manufacturer Part Number: R0603_5K76_0.1%_0.063W_10PPM; Case: 0603; Mounted: Yes; Socket: No; SMD: Yes; Manufacturer1 Example: TYCO HOLSWORTHY; Manufacturer1 ComponentHeight: 0.5mm; HelpURL: \\cern.ch\dfs\Applications\Altium\Datasheets\R0603_Tyco_RN73.pdf; Author: CERN DEM JLC; CreateDate: 12/3/2007; LatestRevisionDate: 3/13/2008; ClassName: PSU_1V2
R26 R36 = R0603_1K_1%_0.1W_100PPM: Resistor - 1%; Part Description: General Purpose Thick Film Chip Resistor; Manufacturer: GENERIC; Manufacturer1 Part Number: NRC06F1001TRF; Manufacturer1 Datasheet: \\cern.ch\dfs\Applications\Altium\Datasheets\R0603_NIC_NRC.pdf; Power: 0.1W; TC: ±100ppm/°C; Table: Resistors SMD; Part Number: R0603_1K_1%_0.1W_100PPM; Component Kind: Standard; Component Type: Standard; Designator: Resistor - 1%; Library Reference: Resistor - 1%; Pin Count: 2; Value: 1k; Status: Preferred; Tolerance: ±1%; Manufacturer Part Number: R0603_1K_1%_0.1W_100PPM; Case: 0603; Mounted: Yes; Socket: No; SMD: Yes; Manufacturer1 Example: NIC COMPONENT; Manufacturer1 ComponentHeight: 0.55mm; HelpURL: \\cern.ch\dfs\Applications\Altium\Datasheets\R0603_NIC_NRC.pdf; Author: CERN DEM JLC; CreateDate: 12/3/2007; LatestRevisionDate: 3/13/2008
  R26: ClassName: PSU_2V5
  R36: ClassName: PSU_3V3
R27 R37 = R0603_100K_0.1%_0.063W_10PPM: Resistor - 0.1%; Part Description: Thin Film Chip Resistor; Manufacturer: GENERIC; Manufacturer1 Part Number: RN73C1J100KBTDF; Manufacturer1 Datasheet: \\cern.ch\dfs\Applications\Altium\Datasheets\R0603_Tyco_RN73.pdf; Power: 0.063W; TC: ±10ppm; Table: Resistors SMD; Part Number: R0603_100K_0.1%_0.063W_10PPM; Component Kind: Standard; Component Type: Standard; Designator: Resistor - 0.1%; Library Reference: Resistor - 0.1%; Pin Count: 2; Value: 100k; Status: Not recommended; Tolerance: ±0.1%; Manufacturer Part Number: R0603_100K_0.1%_0.063W_10PPM; Case: 0603; Mounted: Yes; Socket: No; SMD: Yes; Manufacturer1 Example: TYCO HOLSWORTHY; Manufacturer1 ComponentHeight: 0.5mm; HelpURL: \\cern.ch\dfs\Applications\Altium\Datasheets\R0603_Tyco_RN73.pdf; Author: CERN DEM JLC; CreateDate: 12/3/2007; LatestRevisionDate: 3/13/2008
  R27: ClassName: PSU_2V5
  R37: ClassName: PSU_3V3
R28 R42 = R0603_12K_1%_0.1W_100PPM: Resistor - 1%; Part Description: General Purpose Thick Film Chip Resistor; Manufacturer: GENERIC; Manufacturer1 Part Number: NRC06F1202TRF; Manufacturer1 Datasheet: \\cern.ch\dfs\Applications\Altium\Datasheets\R0603_NIC_NRC.pdf; Power: 0.1W; TC: ±100ppm/°C; Table: Resistors SMD; Part Number: R0603_12K_1%_0.1W_100PPM; Component Kind: Standard; Component Type: Standard; Designator: Resistor - 1%; Library Reference: Resistor - 1%; Pin Count: 2; Value: 12k; Status: Preferred; Tolerance: ±1%; Manufacturer Part Number: R0603_12K_1%_0.1W_100PPM; Case: 0603; Mounted: Yes; Socket: No; SMD: Yes; Manufacturer1 Example: NIC COMPONENT; Manufacturer1 ComponentHeight: 0.55mm; HelpURL: \\cern.ch\dfs\Applications\Altium\Datasheets\R0603_NIC_NRC.pdf; Author: CERN DEM JLC; CreateDate: 12/3/2007; LatestRevisionDate: 3/13/2008
  R28: ClassName: PSU_2V5
  R42: ClassName: PSU_3V3
R29 = R0603_220R_1%_0.1W_100PPM: Resistor - 1%; Part Description: General Purpose Thick Film Chip Resistor; Manufacturer: GENERIC; Manufacturer1 Part Number: NRC06F2200TRF; Manufacturer1 Datasheet: \\cern.ch\dfs\Applications\Altium\Datasheets\R0603_NIC_NRC.pdf; Power: 0.1W; TC: ±100ppm/°C; Table: Resistors SMD; Part Number: R0603_220R_1%_0.1W_100PPM; Component Kind: Standard; Component Type: Standard; Designator: Resistor - 1%; Library Reference: Resistor - 1%; Pin Count: 2; Value: 220; Status: Preferred; Tolerance: ±1%; Manufacturer Part Number: R0603_220R_1%_0.1W_100PPM; Case: 0603; Mounted: Yes; Socket: No; SMD: Yes; Manufacturer1 Example: NIC COMPONENT; Manufacturer1 ComponentHeight: 0.55mm; HelpURL: \\cern.ch\dfs\Applications\Altium\Datasheets\R0603_NIC_NRC.pdf; Author: CERN DEM JLC; CreateDate: 12/3/2007; LatestRevisionDate: 3/13/2008; ClassName: PSU_2V5
R30 = R0603_24K_1%_0.1W_100PPM: Resistor - 1%; Part Description: General Purpose Thick Film Chip Resistor; Manufacturer: GENERIC; Manufacturer1 Part Number: NRC06F2402TRF; Manufacturer1 Datasheet: \\cern.ch\dfs\Applications\Altium\Datasheets\R0603_NIC_NRC.pdf; Power: 0.1W; TC: ±100ppm/°C; Table: Resistors SMD; Part Number: R0603_24K_1%_0.1W_100PPM; Component Kind: Standard; Component Type: Standard; Designator: Resistor - 1%; Library Reference: Resistor - 1%; Pin Count: 2; Value: 24k; Status: Preferred; Tolerance: ±1%; Manufacturer Part Number: R0603_24K_1%_0.1W_100PPM; Case: 0603; Mounted: Yes; Socket: No; SMD: Yes; Manufacturer1 Example: NIC COMPONENT; Manufacturer1 ComponentHeight: 0.55mm; HelpURL: \\cern.ch\dfs\Applications\Altium\Datasheets\R0603_NIC_NRC.pdf; Author: CERN DEM JLC; CreateDate: 12/3/2007; LatestRevisionDate: 3/13/2008; ClassName: PSU_2V5
R31 = R0603_39K_1%_0.1W_100PPM: Resistor - 1%; Part Description: General Purpose Thick Film Chip Resistor; Manufacturer: GENERIC; Manufacturer1 Part Number: NRC06F3902TRF; Manufacturer1 Datasheet: \\cern.ch\dfs\Applications\Altium\Datasheets\R0603_NIC_NRC.pdf; Power: 0.1W; TC: ±100ppm/°C; Table: Resistors SMD; Part Number: R0603_39K_1%_0.1W_100PPM; Component Kind: Standard; Component Type: Standard; Designator: Resistor - 1%; Library Reference: Resistor - 1%; Pin Count: 2; Value: 39k; Status: Preferred; Tolerance: ±1%; Manufacturer Part Number: R0603_39K_1%_0.1W_100PPM; Case: 0603; Mounted: Yes; Socket: No; SMD: Yes; Manufacturer1 Example: NIC COMPONENT; Manufacturer1 ComponentHeight: 0.55mm; HelpURL: \\cern.ch\dfs\Applications\Altium\Datasheets\R0603_NIC_NRC.pdf; Author: CERN DEM JLC; CreateDate: 12/3/2007; LatestRevisionDate: 3/13/2008; ClassName: PSU_2V5
R33 = R0603_43K_1%_0.1W_100PPM: Resistor - 1%; Part Description: General Purpose Thick Film Chip Resistor; Manufacturer: GENERIC; Manufacturer1 Part Number: NRC06F4302TRF; Manufacturer1 Datasheet: \\cern.ch\dfs\Applications\Altium\Datasheets\R0603_NIC_NRC.pdf; Power: 0.1W; TC: ±100ppm/°C; Table: Resistors SMD; Part Number: R0603_43K_1%_0.1W_100PPM; Component Kind: Standard; Component Type: Standard; Designator: Resistor - 1%; Library Reference: Resistor - 1%; Pin Count: 2; Value: 43k; Status: Preferred; Tolerance: ±1%; Manufacturer Part Number: R0603_43K_1%_0.1W_100PPM; Case: 0603; Mounted: Yes; Socket: No; SMD: Yes; Manufacturer1 Example: NIC COMPONENT; Manufacturer1 ComponentHeight: 0.55mm; HelpURL: \\cern.ch\dfs\Applications\Altium\Datasheets\R0603_NIC_NRC.pdf; Author: CERN DEM JLC; CreateDate: 12/3/2007; LatestRevisionDate: 3/13/2008; ClassName: PSU_3V3
R34 = R0402_1K_1%_0.0625W_100PPM: Resistor - 1%; Part Description: General Purpose Thick Film Chip Resistor; Manufacturer: GENERIC; Manufacturer1 Part Number: 232270671002; Manufacturer1 Datasheet: \\cern.ch\dfs\Applications\Altium\Datasheets\R0402_Phycomp_RC0402.pdf; TC: ±100ppm/°C; Table: Resistors SMD; Part Number: R0402_1K_1%_0.0625W_100PPM; Component Kind: Standard; Component Type: Standard; Designator: Resistor - 1%; Library Reference: Resistor - 1%; Pin Count: 2; Value: 1k; Status: Not recommended; Power: 0.0625W; Tolerance: ±1%; Manufacturer Part Number: R0402_1K_1%_0.0625W_100PPM; Case: 0402; Mounted: Yes; Socket: No; SMD: Yes; Manufacturer1 Example: PHYCOMP; Manufacturer1 ComponentHeight: 0.4mm; HelpURL: \\cern.ch\dfs\Applications\Altium\Datasheets\R0402_Phycomp_RC0402.pdf; Author: CERN DEM JLC; CreateDate: 12/3/2007; LatestRevisionDate: 3/13/2008
R35 = R0603_91K_1%_0.1W_100PPM: Resistor - 1%; Part Description: General Purpose Thick Film Chip Resistor; Manufacturer: GENERIC; Manufacturer1 Part Number: NRC06F9102TRF; Manufacturer1 Datasheet: \\cern.ch\dfs\Applications\Altium\Datasheets\R0603_NIC_NRC.pdf; Power: 0.1W; TC: ±100ppm/°C; Table: Resistors SMD; Part Number: R0603_91K_1%_0.1W_100PPM; Component Kind: Standard; Component Type: Standard; Designator: Resistor - 1%; Library Reference: Resistor - 1%; Pin Count: 2; Value: 91k; Status: Preferred; Tolerance: ±1%; Manufacturer Part Number: R0603_91K_1%_0.1W_100PPM; Case: 0603; Mounted: Yes; Socket: No; SMD: Yes; Manufacturer1 Example: NIC COMPONENT; Manufacturer1 ComponentHeight: 0.55mm; HelpURL: \\cern.ch\dfs\Applications\Altium\Datasheets\R0603_NIC_NRC.pdf; Author: CERN DEM JLC; CreateDate: 12/3/2007; LatestRevisionDate: 3/13/2008; ClassName: PSU_3V3
R41 = R0603_330R_1%_0.1W_100PPM: Resistor - 1%; Part Description: General Purpose Thick Film Chip Resistor; Manufacturer: GENERIC; Manufacturer1 Part Number: NRC06F3300TRF; Manufacturer1 Datasheet: \\cern.ch\dfs\Applications\Altium\Datasheets\R0603_NIC_NRC.pdf; Power: 0.1W; TC: ±100ppm/°C; Table: Resistors SMD; Part Number: R0603_330R_1%_0.1W_100PPM; Component Kind: Standard; Component Type: Standard; Designator: Resistor - 1%; Library Reference: Resistor - 1%; Pin Count: 2; Value: 330; Status: Preferred; Tolerance: ±1%; Manufacturer Part Number: R0603_330R_1%_0.1W_100PPM; Case: 0603; Mounted: Yes; Socket: No; SMD: Yes; Manufacturer1 Example: NIC COMPONENT; Manufacturer1 ComponentHeight: 0.55mm; HelpURL: \\cern.ch\dfs\Applications\Altium\Datasheets\R0603_NIC_NRC.pdf; Author: CERN DEM JLC; CreateDate: 12/3/2007; LatestRevisionDate: 3/13/2008; ClassName: PSU_3V3
R44 = R0603_27K_1%_0.1W_100PPM: Resistor - 1%; Part Description: General Purpose Thick Film Chip Resistor; Manufacturer: GENERIC; Manufacturer1 Part Number: NRC06F2702TRF; Manufacturer1 Datasheet: \\cern.ch\dfs\Applications\Altium\Datasheets\R0603_NIC_NRC.pdf; Power: 0.1W; TC: ±100ppm/°C; Table: Resistors SMD; Part Number: R0603_27K_1%_0.1W_100PPM; Component Kind: Standard; Component Type: Standard; Designator: Resistor - 1%; Library Reference: Resistor - 1%; Pin Count: 2; Value: 27k; Status: Preferred; Tolerance: ±1%; Manufacturer Part Number: R0603_27K_1%_0.1W_100PPM; Case: 0603; Mounted: Yes; Socket: No; SMD: Yes; Manufacturer1 Example: NIC COMPONENT; Manufacturer1 ComponentHeight: 0.55mm; HelpURL: \\cern.ch\dfs\Applications\Altium\Datasheets\R0603_NIC_NRC.pdf; Author: CERN DEM JLC; CreateDate: 12/3/2007; LatestRevisionDate: 3/13/2008; ClassName: PSU_3V3
R96-R98 = Res2: Resistor; Published: 8-Jun-2000; Revision: July-2002: Re-released for DXP Platform.; Publisher: Altium Limited; ClassName: PSU_2V5; Supplier: Farnell
  R96: ClassName: PSU_1V2
  R98: ClassName: PSU_3V3
R103-R108 = R0402_10K_1%_0.0625W_100PPM: Resistor - 1%; Part Description: General Purpose Thick Film Chip Resistor; Manufacturer: GENERIC; Manufacturer1 Part Number: 232270671003; Manufacturer1 Datasheet: \\cern.ch\dfs\Applications\Altium\Datasheets\R0402_Phycomp_RC0402.pdf; TC: ±100ppm/°C; Table: Resistors SMD; Part Number: R0402_10K_1%_0.0625W_100PPM; Component Kind: Standard; Component Type: Standard; Designator: Resistor - 1%; Library Reference: Resistor - 1%; Pin Count: 2; Value: 10k; Status: Not recommended; Power: 0.0625W; Tolerance: ±1%; Manufacturer Part Number: R0402_10K_1%_0.0625W_100PPM; Case: 0402; Mounted: Yes; Socket: No; SMD: Yes; Manufacturer1 Example: PHYCOMP; Manufacturer1 ComponentHeight: 0.4mm; HelpURL: \\cern.ch\dfs\Applications\Altium\Datasheets\R0402_Phycomp_RC0402.pdf; Author: CERN DEM JLC; CreateDate: 12/3/2007; LatestRevisionDate: 3/13/2008